# EAGLE design opendecoder (EAGLE 6.4)
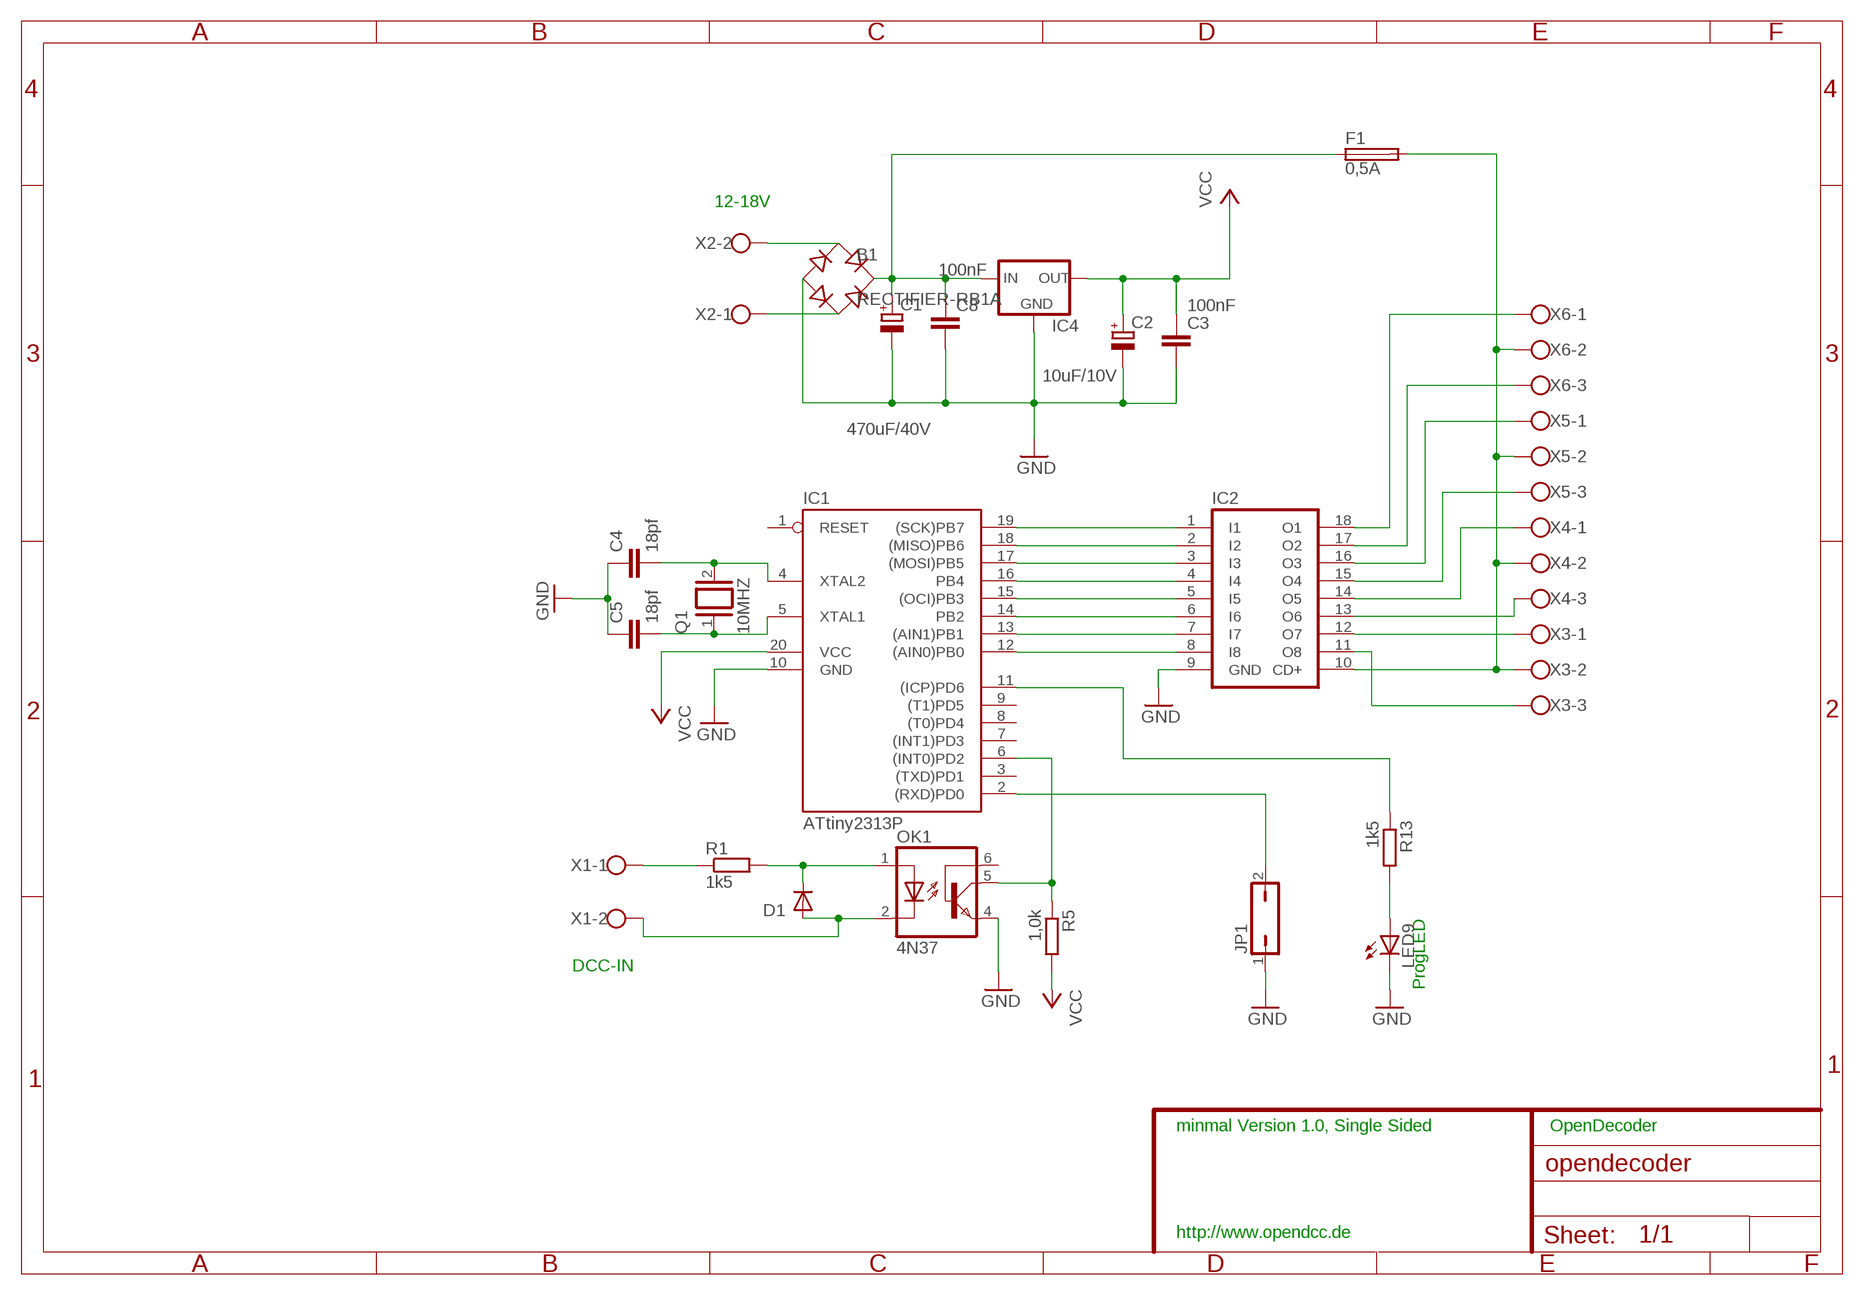
[diagram p0: schematic, sheet 1]

## Parts
B1  RECTIFIER-RB1A  [RB1A]
C1  470uF/40V  CPOL-EUE5-10.5  [E5-10,5]
C2  10uF/10V  CPOL-EUE5-6  [E5-6]
C3  100nF  C-EU025_050-025X075  [C025_050-025X075]
C4  18pf  C-EU025-025X050  [C025-025X050]
C5  18pf  C-EU025-025X050  [C025-025X050]
C8  100nF  C-EU050-024X044  [C050-024X044]
D1  DIODE-D-2.5  [D-2.5]
F1  0,5A  TE5  [TE5]
IC1  ATtiny2313P  AT90S2313P  [DIL20]
IC2  ULN2803A  [DIL18]
IC4  78XXS  [78XXS]
JP1  JP1Q  [JP1]
LED9  LED3MM  [LED3MM]
OK1  4N37  [DIL06]
Q1  10MHZ  XTAL/S  [QS]
R1  1k5  R-EU_0204/2V  [0204V]
R5  1,0k  R-EU_0207/2V  [0207/2V]
R13  1k5  R-EU_0204/2V  [0204V]
X1  AK550/2  [AK550/2]
X2  AK550/2  [AK550/2]
X3  AK550/3  [AK550/3]
X4  AK550/3  [AK550/3]
X5  AK550/3  [AK550/3]
X6  AK550/3  [AK550/3]

## Nets
GND: B1.- C1.- C2.- C3.2 C4.1 C5.1 C8.2 IC1.10(GND) IC2.9(GND) IC4.GND JP1.1 LED9.K(C) OK1.4(EMI)
N$1: IC1.19((SCK)PB7) IC2.1(I1)
N$2: IC2.16(O3) X5.1
N$3: B1.AC1 X2.2
N$4: B1.AC2 X2.1
N$5: IC1.18((MISO)PB6) IC2.2(I2)
N$6: IC1.17((MOSI)PB5) IC2.3(I3)
N$7: IC1.6((INT0)PD2) OK1.5(COL) R5.1
N$8: D1.A OK1.2(C) X1.2
N$9: R1.1 X1.1
N$10: IC1.16(PB4) IC2.4(I4)
N$11: IC1.15((OCI)PB3) IC2.5(I5)
N$12: IC1.14(PB2) IC2.6(I6)
N$13: IC1.13((AIN1)PB1) IC2.7(I7)
N$14: IC1.12((AIN0)PB0) IC2.8(I8)
N$15: IC2.17(O2) X6.3
N$16: B1.+ C1.+ C8.1 F1.1 IC4.IN
N$17: IC2.11(O8) X3.3
N$18: IC2.13(O6) X4.3
N$19: IC2.12(O7) X3.1
N$20: IC2.14(O5) X4.1
N$21: IC2.15(O4) X5.3
N$22: IC2.18(O1) X6.1
N$23: F1.2 IC2.10(CD+) X3.2 X4.2 X5.2 X6.2
N$26: C4.2 IC1.4(XTAL2) Q1.2
N$27: C5.2 IC1.5(XTAL1) Q1.1
N$29: D1.C OK1.1(A) R1.2
N$44: IC1.2((RXD)PD0) JP1.2
N$45: IC1.11((ICP)PD6) R13.1
N$47: LED9.A R13.2
VCC: C2.+ C3.1 IC1.20(VCC) IC4.OUT R5.2
Unconnected: IC1.1(RESET) IC1.3((TXD)PD1) IC1.7((INT1)PD3) IC1.8((T0)PD4) IC1.9((T1)PD5) OK1.6(BAS)

## Notes on the sheet
- 12-18V
- DCC-IN
- ProgLED
- minmal Version 1.0, Single Sided | OpenDecoder
- http://www.opendcc.de

## Library data of the parts
B1 = rectifier:RECTIFIER-: Rectifier
C1 C2 = rcl:CPOL-EU: POLARIZED CAPACITOR, European symbol
C3-C5 C8 = rcl:C-EU: CAPACITOR, European symbol
D1 = diode:DIODE-: DIODE
F1 = fuse:TE5: FUSE Wickmann; OC_FARNELL: unknown; OC_NEWARK: unknown
IC1 = atmel:AT90S2313: MICROCONTROLLER 2 Kbytes FLASH 128 bytes SRAM 128 bytes EEPROM UART
IC2 = uln-udn:ULN2803A: DRIVER ARRAY
IC4 = v-reg:78XXS: VOLTAGE REGULATOR
JP1 = jumper:JP1Q: JUMPER
LED9 = led:LED: LED OSRAM: - CHIPLED LG R971, LG N971, LY N971, LG Q971, LY Q971, LO R971, LY R971 LH N974, LH R974 LS Q976, LO Q976, LY Q976 LO Q996 - Hyper CHIPLED LW Q18S LB Q993, LB Q99A, LB R99A - SideLED LS A670, LO A670, LY A670, LG A670, LP A670 LB A673, LV A673, LT A673, LW A673 LH A674 LY A675 LS A676, LA A676, LO A676, LY A676, LW A676 LS A679, LY A679, LG A679 - Hyper Micro SIDELED® LS Y876, LA Y876, LO Y876, LY Y876 LT Y87S - SmartLED LW L88C, LW L88S LB L89C, LB L89S, LG L890 LS L89K, LO L89K, LY L89K LS L896, LA L896, LO L896, LY L896 - TOPLED LS T670, LO T670, LY T670, LG T670, LP T670 LSG T670, LSP T670, LSY T670, LOP T670, LYG T670 LG T671, LOG T671, LSG T671 LB T673, LV T673, LT T673, LW T673 LH T674 LS T676, LA T676, LO T676, LY T676, LB T676, LH T676, LSB T676, LW T676 LB T67C, LV T67C, LT T67C, LS T67K, LO T67K, LY T67K, LW E67C LS E67B, LA E67B, LO E67B, LY E67B, LB E67C, LV E67C, LT E67C LW T67C LS T679, LY T679, LG T679 LS T770, LO T770, LY T770, LG T770, LP T770 LB T773, LV T773, LT T773, LW T773 LH T774 LS E675, LA E675, LY E675, LS T675 LS T776, LA T776, LO T776, LY T776, LB T776 LHGB T686 LT T68C, LB T68C - Hyper Mini TOPLED® LB M676 - Mini TOPLED Santana® LG M470 LS M47K, LO M47K, LY M47K Source: http://www.osram.convergy.de/
OK1 = optocoupler:4N37: OPTO COUPLER Source: http://www.fairchildsemi.com/pf/4N/4N35-M.html; MF: FAIRCHILD SEMICONDUCTOR; MPN: 4N37; OC_FARNELL: 1612456; OC_NEWARK: 72K9948
Q1 = special:XTAL/S: CRYSTAL
R1 R5 R13 = rcl:R-EU_: RESISTOR, European symbol
X1 X2 = con-ptr500+:AK550/2: CONNECTOR
X3-X6 = con-ptr500+:AK550/3: CONNECTOR

## Board
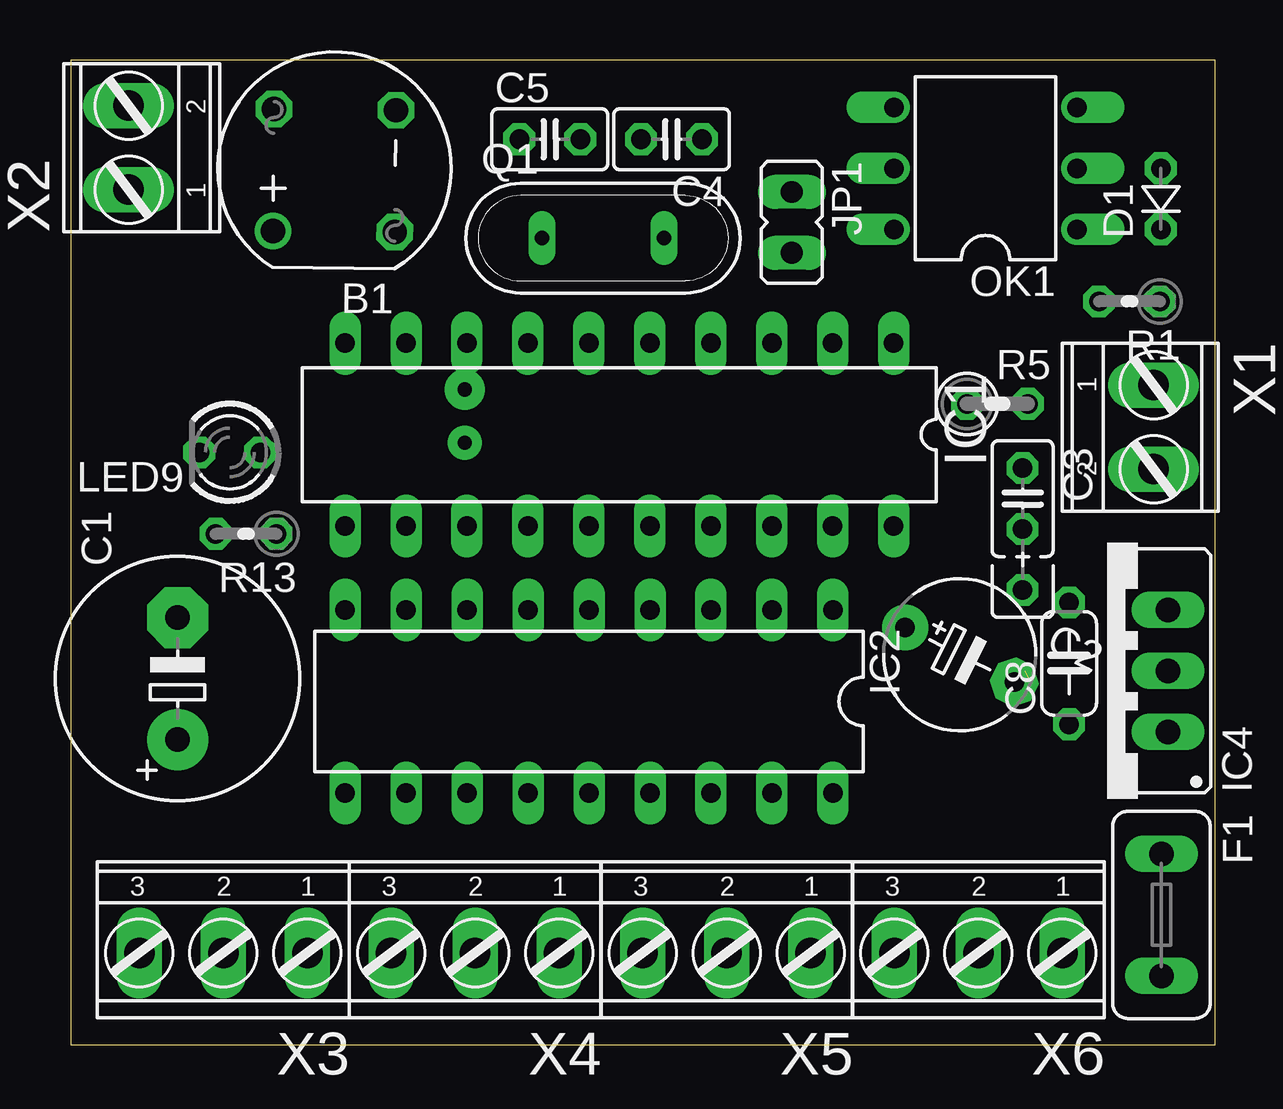
[diagram p1: board, top side]
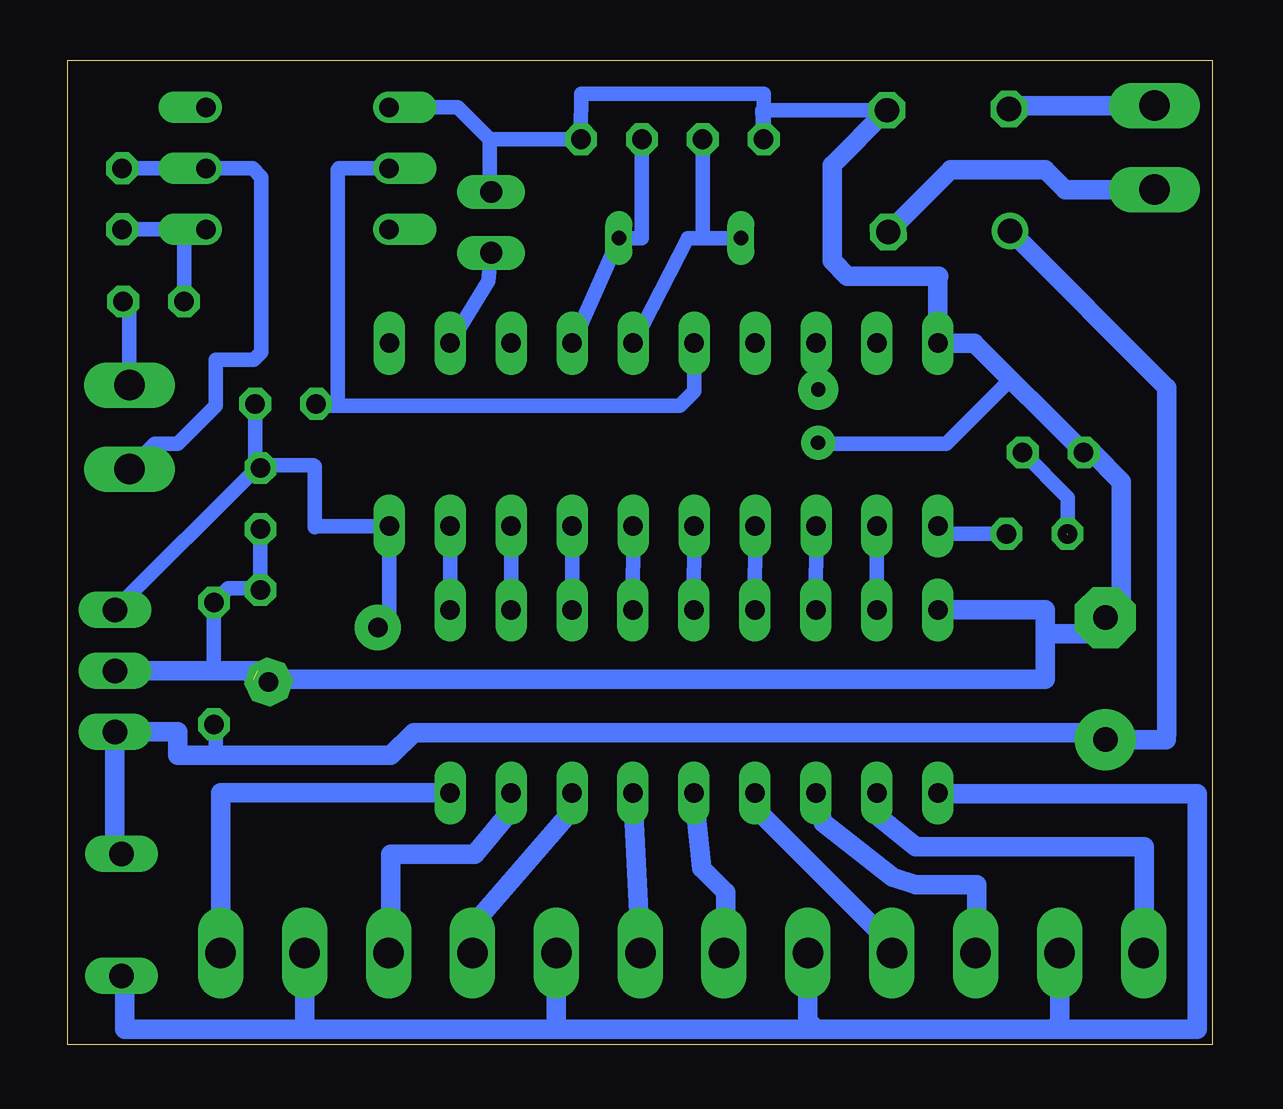
[diagram p2: board, bottom side, seen from below]

Size 47.7 x 41.01 mm. Coordinates in mm from the lower left corner, seen from the top.
Outline: 0,0 47.7,0 47.7,41.01 0,41.01 0,0
Copper layers (1*16): Top 0.035mm / dielectric 1.5mm / Bottom 0.035mm
Design rules "default *": minimum track width 10mil, minimum drill 24mil, track to track 8mil, track to pad 8mil, pad to pad 8mil, via to via 8mil, smd to smd 8mil, copper to edge 40mil, drill to drill 8mil, minimum pad ring 10mil, minimum via ring 8mil, stop-mask expansion 4mil, vias tented up to drill 0mil, thermal gap 10mil

### Footprints (pad centres in the part's own frame; a part is rotated, then mirrored left to right if it is on the bottom)
RB1A = drill 1.016: + -2.54,2.54 | drill 1.016 octagon: - 2.54,-2.54; AC1 2.54,2.54; AC2 -2.54,-2.54
E5-10,5 = drill 1.016 pad 2.54: + -2.54,0 | drill 1.016 pad 2.54 octagon: - 2.54,0
E5-6 = drill 0.813 pad 1.905: + -2.54,0 | drill 0.813 pad 1.905 octagon: - 2.54,0
C025_050-025X075 = drill 0.813 octagon: 1 -1.27,0; 2 1.27,0; 3 3.81,0
C025-025X050 = drill 0.813 octagon: 1 -1.27,0; 2 1.27,0
C050-024X044 = drill 0.813 octagon: 1 -2.54,0; 2 2.54,0
D-2.5 = drill 0.813 octagon: A 1.27,0; C -1.27,0
TE5 = drill 1.016 long: 1 -2.54,0; 2 2.54,0
DIL20 = drill 0.813 long: 1 -11.43,-3.81; 2 -8.89,-3.81; 3 -6.35,-3.81; 4 -3.81,-3.81; 5 -1.27,-3.81; 6 1.27,-3.81; 7 3.81,-3.81; 8 6.35,-3.81; 9 8.89,-3.81; 10 11.43,-3.81; 11 11.43,3.81; 12 8.89,3.81; 13 6.35,3.81; 14 3.81,3.81; 15 1.27,3.81; 16 -1.27,3.81; 17 -3.81,3.81; 18 -6.35,3.81; 19 -8.89,3.81; 20 -11.43,3.81
DIL18 = drill 0.813 long: 1 -10.16,-3.81; 2 -7.62,-3.81; 3 -5.08,-3.81; 4 -2.54,-3.81; 5 0,-3.81; 6 2.54,-3.81; 7 5.08,-3.81; 8 7.62,-3.81; 9 10.16,-3.81; 10 10.16,3.81; 11 7.62,3.81; 12 5.08,3.81; 13 2.54,3.81; 14 0,3.81; 15 -2.54,3.81; 16 -5.08,3.81; 17 -7.62,3.81; 18 -10.16,3.81
78XXS = drill 1.016 long: GND 0,-2.54; IN -2.54,-2.54; OUT 2.54,-2.54
JP1 = drill 0.914 long: 1 0,-1.27; 2 0,1.27
LED3MM = drill 0.813 octagon: A -1.27,0; K 1.27,0
DIL06 = drill 0.813 offset: 1 -2.54,-3.81; 2 0,-3.81; 3 2.54,-3.81; 4 2.54,3.81; 5 0,3.81; 6 -2.54,3.81
QS = drill 0.61 long: 1 -2.54,0; 2 2.54,0
0204V = drill 0.813 octagon: 1 -1.27,0; 2 1.27,0
0207/2V = drill 0.813 octagon: 1 -1.27,0; 2 1.27,0
AK550/2 = drill 1.27 long: 1 -1.75,0; 2 1.75,0
AK550/3 = drill 1.27 long: 1 -3.5,0; 2 0,0; 3 3.5,0

### Placement (x,y rotation side)
B1  11,36.42 89.4 top
C1  4.46,15.25 90 top
C2  37.05,16.24 333.5 top
C3  39.67,22.75 270 top
C4  25.04,37.72 180 top
C5  19.97,37.72 0 top
C8  41.61,15.89 90 top
D1  45.43,35.24 90 top
F1  45.45,5.41 270 top
IC1  22.87,25.42 180 top
IC2  21.61,14.3 180 top
IC4  43.19,15.57 90 top
JP1  30.06,34.26 180 top
LED9  6.64,24.67 180 top
OK1  38.12,36.51 90 top
Q1  22.19,33.6 0 top
R1  44.12,30.96 180 top
R5  38.62,26.7 0 top
R13  7.32,21.28 180 top
X1  45.13,25.73 270 top
X2  2.42,37.37 90 top
X3  6.37,3.82 180 top
X4  16.86,3.82 180 top
X5  27.34,3.82 180 top
X6  37.83,3.82 180 top

### Tracks (layer width: path | path; a pad name or v marks a point on that pad's centre or on a via)
GND  (1 unrouted)
  Bottom 0.406: 26.31,38.04 C4.1 | 30.11,35.59 JP1.1
  Bottom 0.61: B1.- 18.76,38.93 C5.1 18.7,39.62 26.31,39.62 26.31,38.04 | C4.1 30.11,37.72 | 30.11,37.72 30.11,35.59 | OK1.4 31.44,39.05 30.11,37.72 | C3.2 39.67,19.07 39.62,19.02 41.01,19.02 C8.2 41.61,15.65 41.53,15.57
  Bottom 0.813: IC2.9 6.97,18.11 6.97,17.12 | 6.97,17.12 4.46,17.12 C1.- 3.8,18.13 3.8,23.46 5.02,24.67 LED9.K 9.92,29.23 IC1.10 11.44,31.99 11.41,32.02 15.22,32.02 15.85,32.65 15.85,36.65 B1.- | 39.83,15.11 39.94,15.22 6.97,15.22 6.97,17.12 | IC4.GND 41.53,15.57 39.79,15.57 C2.-
N$1
  Bottom 0.61: IC1.19 IC2.1
N$2
  Bottom 0.813: IC2.16 26.69,9.77 30.75,5.07 30.75,3.91 X5.1
N$3
  Bottom 0.813: X2.2 8.48,39.12 B1.AC1
N$4
  Bottom 0.813: X2.1 6.14,35.62 6.97,36.45 10.91,36.45 B1.AC2
N$5
  Bottom 0.61: IC1.18 IC2.2
N$6
  Bottom 0.61: IC1.17 IC2.3
N$7
  Bottom 0.406: 37.42,26.63 R5.1 | 36.4,36.51 36.45,36.45
  Bottom 0.61: IC1.6 21.6,27.22 22.19,26.63 36.45,26.63 | 36.45,26.63 37.42,26.63 | OK1.5 36.4,36.51 | 36.45,36.45 36.45,26.63
N$8
  Bottom 0.61: OK1.2 D1.A 40,36.51 39.62,36.14 39.62,28.85 39.94,28.53 41.53,28.53 41.53,26.63 43.11,25.04 44.07,25.04 X1.2
N$9
  Bottom 0.61: X1.1 45.13,30.7 R1.1
N$10
  Bottom 0.61: IC1.16 IC2.4
N$11
  Bottom 0.61: IC1.15 IC2.5
N$12
  Bottom 0.61: IC1.14 IC2.6
N$13
  Bottom 0.61: IC1.13 IC2.7
N$14
  Bottom 0.61: IC1.12 IC2.8
N$15
  Bottom 0.813: IC2.17 29.23,9.77 30.75,7.92 34.24,7.92 34.24,3.91 X6.3
N$16
  Bottom 0.61: C8.1 41.53,13.35 41.53,12.05
  Bottom 0.813: B1.+ 1.9,27.38 1.9,13 1.93,12.71 C1.+ 5.06,13 33.28,13 34.24,12.05 41.53,12.05 43.11,12.05 43.11,13.03 IC4.IN 45.73,7.95 F1.1
N$17
  Bottom 0.813: IC2.11 13.99,9.55 12.36,8.24 2.85,8.24 2.85,3.84 X3.3
N$18
  Bottom 0.813: IC2.13 19.07,9.87 13.63,4.44 13.63,4.09 X4.3
N$19
  Bottom 0.813: IC2.12 16.21,9.23 13.31,6.97 12.36,6.66 9.83,6.66 9.83,3.86 X3.1
N$20
  Bottom 0.813: IC2.14 21.29,7.34 20.29,6.34 20.29,3.89 X4.1
N$21
  Bottom 0.813: IC2.15 23.83,3.83 X5.3
N$22
  Bottom 0.813: IC2.18 41.33,10.49 X6.1
N$23
  Bottom 0.813: 37.72,0.63 45.33,0.63 45.33,2.74 F1.2 | 37.72,0.63 27.58,0.63 | 27.58,0.63 16.48,0.63 | 16.48,0.63 6.66,0.63 | 6.66,0.63 0.63,0.63 0.63,10.46 11.45,10.46 IC2.10 | X3.2 6.37,0.92 6.66,0.63 | X4.2 16.86,1.01 16.48,0.63 | X5.2 27.34,0.87 27.58,0.63 | X6.2 37.83,0.74 37.72,0.63
N$24  (via drill 0.6 pad 1.42)
  other vias: 16.43,25.08
N$25  (via drill 0.6 pad 1.68)
  other vias: 16.43,27.3
N$26
  Bottom 0.406: IC1.4 26.63,29.28 | 24.41,33.6 Q1.2 | C4.2
  Bottom 0.61: 26.63,29.28 Q1.2 23.77,33.6 C4.2
N$27
  Bottom 0.406: IC1.5 24.09,29.27 | C5.2
  Bottom 0.61: 24.09,29.27 21.87,33.6 21.24,33.6 | 21.24,33.6 Q1.1 | C5.2 21.24,33.6
N$28
  Bottom 0.61: 16.48,25.04 11.1,25.04 8.56,27.58
N$29
  Bottom 0.61: OK1.1 42.8,33.97 | 42.8,33.97 D1.C | R1.2 42.85,33.92 42.8,33.97
N$44
  Bottom 0.61: JP1.2 30.18,31.8 IC1.2
N$45
  Bottom 0.61: IC1.11 11.12,21.28 R13.1
N$47  (1 unrouted)
  Bottom 0.61: LED9.A 6.02,22.79 6.02,21.24
VCC
  Bottom 0.61: C2.+ 34.3,17.85 IC1.20 37.36,21.61 | 37.36,21.61 37.41,21.56 | 39.55,24.15 C3.1 39.83,24.02 IC4.OUT | 39.55,24.15 37.46,24.15 37.41,24.09 37.41,21.66 37.36,21.61 | 39.55,24.15 39.89,24.49 R5.2